# Altium schematic sheet Solar System Overview.SchDoc
size A4; SheetNumber: 1; SheetTotal: 2
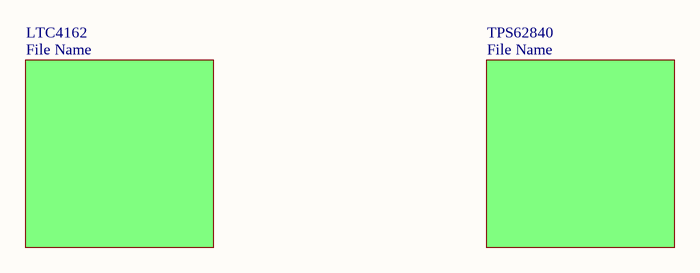
[diagram p0: Solar System Overview.SchDoc]

## Sub-sheets
LTC4162 = File Name: no entries
TPS62840 = File Name: no entries